# Altium schematic sheet Boost_DC_DC.SchDoc
size A4
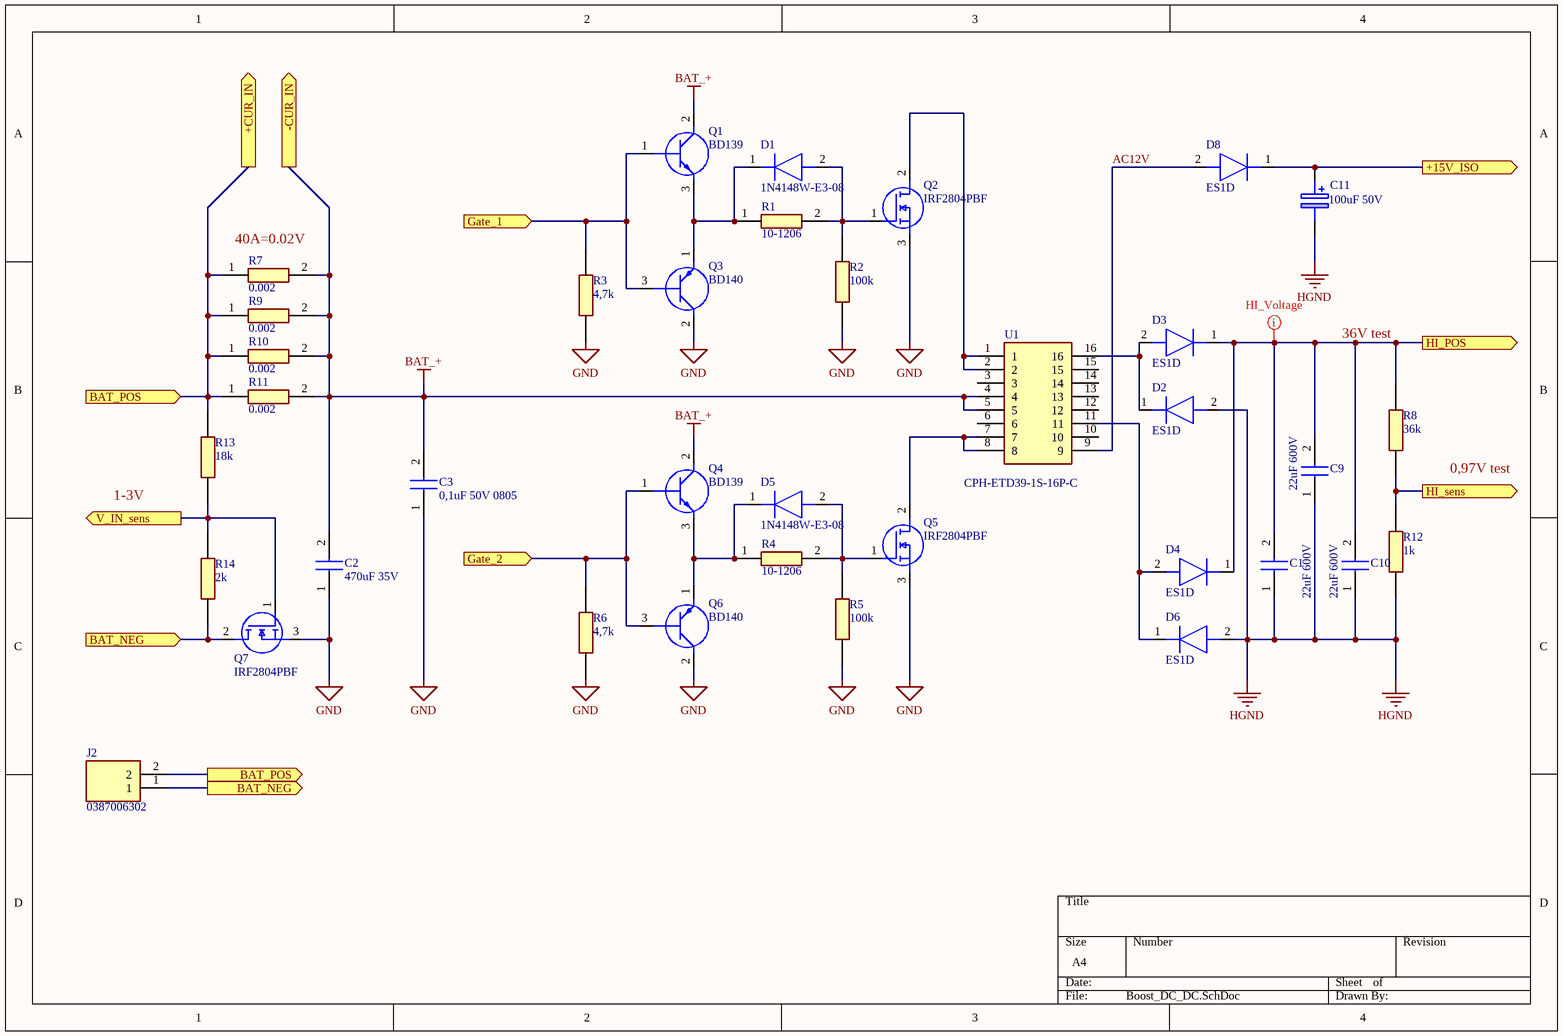
[diagram p0: Boost_DC_DC.SchDoc]

## Parts
C1  22uF 600V  [CAPPRD750W80D1625H2700]
C2  470uF 35V  [CAPPRD750W80D1625H2700]
C3  0,1uF 50V 0805  [CAPC2012X90N]
C9  22uF 600V  [CAPPRD750W80D1625H2700]
C10  22uF 600V  [CAPPRD750W80D1625H2700]
C11  100uF 50V  [CAPPRD500W60D870H1200]
D1  1N4148W-E3-08  [SOD3716X135N]
D2  ES1D  [DIOM5226X295N]
D3  ES1D  [DIOM5226X295N]
D4  ES1D  [DIOM5226X295N]
D5  1N4148W-E3-08  [SOD3716X135N]
D6  ES1D  [DIOM5226X295N]
D8  ES1D  [DIOM5226X295N]
J2  0387006302  [0387006302]
Q1  BD139  [TO254P290X760X1320-3P]
Q2  IRF2804PBF  [TO254P482X1016X2192-3P]
Q3  BD140  [TO229P300X760X1364-3P]
Q4  BD139  [TO254P290X760X1320-3P]
Q5  IRF2804PBF  [TO254P482X1016X2192-3P]
Q6  BD140  [TO229P300X760X1364-3P]
Q7  IRF2804PBF  [TO254P482X1016X2192-3P]
R1  10-1206  [RESC3116X75N]
R2  100k  [RESC2013X65N]
R3  4,7k  [RESC2013X65N]
R4  10-1206  [RESC3116X75N]
R5  100k  [RESC2013X65N]
R6  4,7k  [RESC2013X65N]
R7  0.002  [RESC3116X75N]
R8  36k  [RESC2013X65N]
R9  0.002  [RESC3116X75N]
R10  0.002  [RESC3116X75N]
R11  0.002  [RESC3116X75N]
R12  1k  [RESC2013X65N]
R13  18k  [RESC2013X65N]
R14  2k  [RESC2013X65N]
U1  CPH-ETD39-1S-16P-C  [DIPS3048W80P508L4460H3610Q16N]

## Ports
+15V_ISO (out), +CUR_IN (out), -CUR_IN (out), BAT_NEG (in), BAT_NEG (out), BAT_POS (in), BAT_POS (out), Gate_1 (in), Gate_2 (in), HI_POS (out), HI_sens (out), V_IN_sens (out)

## Nets
BAT_+: C2.2(-) C3.2 Q1.2(C) Q4.2(C) R7.2 R9.2 R10.2 R11.2 U1.4 U1.5 ; port -CUR_IN
GND: C2.1(+) C3.1 Q2.3(S) Q3.2(C) Q5.3(S) Q6.2(C) Q7.3(S) R2.1 R3.1 R5.1 R6.1
HGND: C1.1(+) C9.1(+) C10.1(+) C11.2(-) D2.2(A) D6.2(A) R12.1
+15V_ISO: C11.1(+) D8.1(K) ; port +15V_ISO
+CUR_IN: J2.2 R7.1 R9.1 R10.1 R11.1 R13.2 ; port BAT_POS, port +CUR_IN
AC12V: D8.2(A) U1.9
BAT_NEG: J2.1 Q7.2(D) R14.1 ; port BAT_NEG
Gate_1: Q1.1(B) Q3.3(B) R3.2 ; port Gate_1
Gate_2: Q4.1(B) Q6.3(B) R6.2 ; port Gate_2
HI_POS: C1.2(-) C9.2(-) C10.2(-) D3.1(K) D4.1(K) R8.2 ; port HI_POS
HI_sens: R8.1 R12.2 ; port HI_sens
V_IN_sens: Q7.1(G) R13.1 R14.2 ; port V_IN_sens
NetD1_1: D1.1(K) Q1.3(E) Q3.1(E) R1.1
NetD1_2: D1.2(A) Q2.1(G) R1.2 R2.2
NetD2_1: D2.1(K) D3.2(A) U1.16
NetD4_2: D4.2(A) D6.1(K) U1.11
NetD5_1: D5.1(K) Q4.3(E) Q6.1(E) R4.1
NetD5_2: D5.2(A) Q5.1(G) R4.2 R5.2
NetQ2_2: Q2.2(D) U1.1 U1.2
NetQ5_2: Q5.2(D) U1.7 U1.8

Not connected (* = marked no-connect by the designer): U1 3 6 10 12 13 14 15

## Layout directives
net class HI_Voltage: HI_POS

## Notes on the sheet
- (near R7) 40A=0.02V
- 36V test
- 1-3V
- 0,97V test

## Library data of the parts
C1 C2 C9 C10 = UPW1H102MHD: Capacitor; Height: 27mm
C3 = MCMT21N470F250CT: Capacitor; Height: 0.9mm
C11 = MAL203690109E3: Aluminum Electrolytic Capacitors - Radial Leaded 100uF 50V 20% Radial; Manufacturer_Name: Vishay; Geometry.Height: 12mm; Datasheet Link: https://www.vishay.com/docs/28312/036rsp.pdf; Manufacturer_Part_Number: MAL203690109E3; Mouser Part Number: 594-2222-036-90109; Mouser Price/Stock: https://www.mouser.co.uk/ProductDetail/Vishay-BC-Components/MAL203690109E3?qs=4T%252B5yYZyZYdFWMOgqUZuiA%3D%3D; Arrow Part Number: MAL203690109E3; Arrow Price/Stock: https://www.arrow.com/en/products/mal203690109e3/vishay; Mouser Testing Part Number: *; Mouser Testing Price/Stock: *
D1 D5 = 1N4148W-E3-08: Diode; Manufacturer_Name: Vishay; Datasheet Link: http://www.vishay.com/docs/85748/1n4148w.pdf; Height: 1.35mm; Manufacturer_Part_Number: 1N4148W-E3-08; Mouser Part Number: 78-1N4148W-E3-08; Mouser Price/Stock: https://www.mouser.co.uk/ProductDetail/Vishay-Semiconductors/1N4148W-E3-08?qs=bTzheeSci6TVjpxfjjRVMw%3D%3D; Arrow Part Number: 1N4148W-E3-08; Arrow Price/Stock: https://www.arrow.com/en/products/1n4148w-e3-08/vishay?region=nac
D2-D4 D6 D8 = ES1D: Diode; Manufacturer_Name: SMC; Datasheet Link: https://4donline.ihs.com/images/VipMasterIC/IC/SMCD/SMCD-S-A0005425901/SMCD-S-A0005425901-1.pdf?hkey=833C7E3902CC3CD9C0453977398360A8; Height: 2.95mm; Manufacturer_Part_Number: ES1D
J2 = 0387006302: Connector; Manufacturer_Name: Molex; Datasheet Link: https://datasheet.datasheetarchive.com/originals/distributors/Datasheets-DGA23/1543392.pdf; Height: 13mm; Manufacturer_Part_Number: 0387006302; Mouser Part Number: N/A; Mouser Price/Stock: https://www.mouser.co.uk/ProductDetail/Molex/0387006302/?qs=PBcRNPEHKsoO9p6NPCT14g%3D%3D; Arrow Part Number: 0387006302; Arrow Price/Stock: https://www.arrow.com/en/products/0387006302/molex
Q1 Q4 = BD139: Transistor BJT NPN; Manufacturer_Name: STMicroelectronics; Datasheet Link: http://www.st.com/web/en/resource/technical/document/datasheet/CD00001225.pdf; Height: 2.9mm; Manufacturer_Part_Number: BD139; Mouser Part Number: 511-BD139; Mouser Price/Stock: https://www.mouser.co.uk/ProductDetail/STMicroelectronics/BD139?qs=ljbEvF4DwOPW%2FLxHSWYMMA%3D%3D; Arrow Part Number: BD139; Arrow Price/Stock: https://www.arrow.com/en/products/bd139/stmicroelectronics?region=europe
Q2 Q5 Q7 = IRF2804PBF: MOSFET (N-Channel); Manufacturer_Name: Infineon; Datasheet Link: https://componentsearchengine.com/Datasheets/1/IRF2804PBF.pdf; Height: 4.82mm; Manufacturer_Part_Number: IRF2804PBF; Mouser Part Number: 942-IRF2804PBF; Mouser Price/Stock: https://www.mouser.co.uk/ProductDetail/Infineon-IR/IRF2804PBF?qs=2r01AXMCG3OqtrI77lWLsA%3D%3D; Arrow Part Number: IRF2804PBF; Arrow Price/Stock: https://www.arrow.com/en/products/irf2804pbf/infineon-technologies-ag
Q3 Q6 = BD138: Transistor BJT PNP; Manufacturer_Name: onsemi; Datasheet Link: http://www.onsemi.com/pub/Collateral/BD136-D.PDF; Height: 3mm; Manufacturer_Part_Number: BD138; Mouser Part Number: 863-BD138; Mouser Price/Stock: https://www.mouser.co.uk/ProductDetail/onsemi/BD138?qs=vNc2DXHODiJSpBHA4I4SSg%3D%3D
R1 R4 R7 R9-R11 = MCMR12X1003FTL: Resistor; Height: 0.75mm
R2 R3 R5 R6 R8 R12-R14 = ERJP06J822V: Resistor; Height: 0.7mm
U1 = CPH-ETD39-1S-16P-C: Undefined or Miscellaneous; Manufacturer_Name: FERROXCUBE; Datasheet Link: http://www.farnell.com/datasheets/1935353.pdf; Height: 36.1mm; Manufacturer_Part_Number: CPH-ETD39-1S-16P-C